# Altium project PhMeasureDevice.PrjPcb
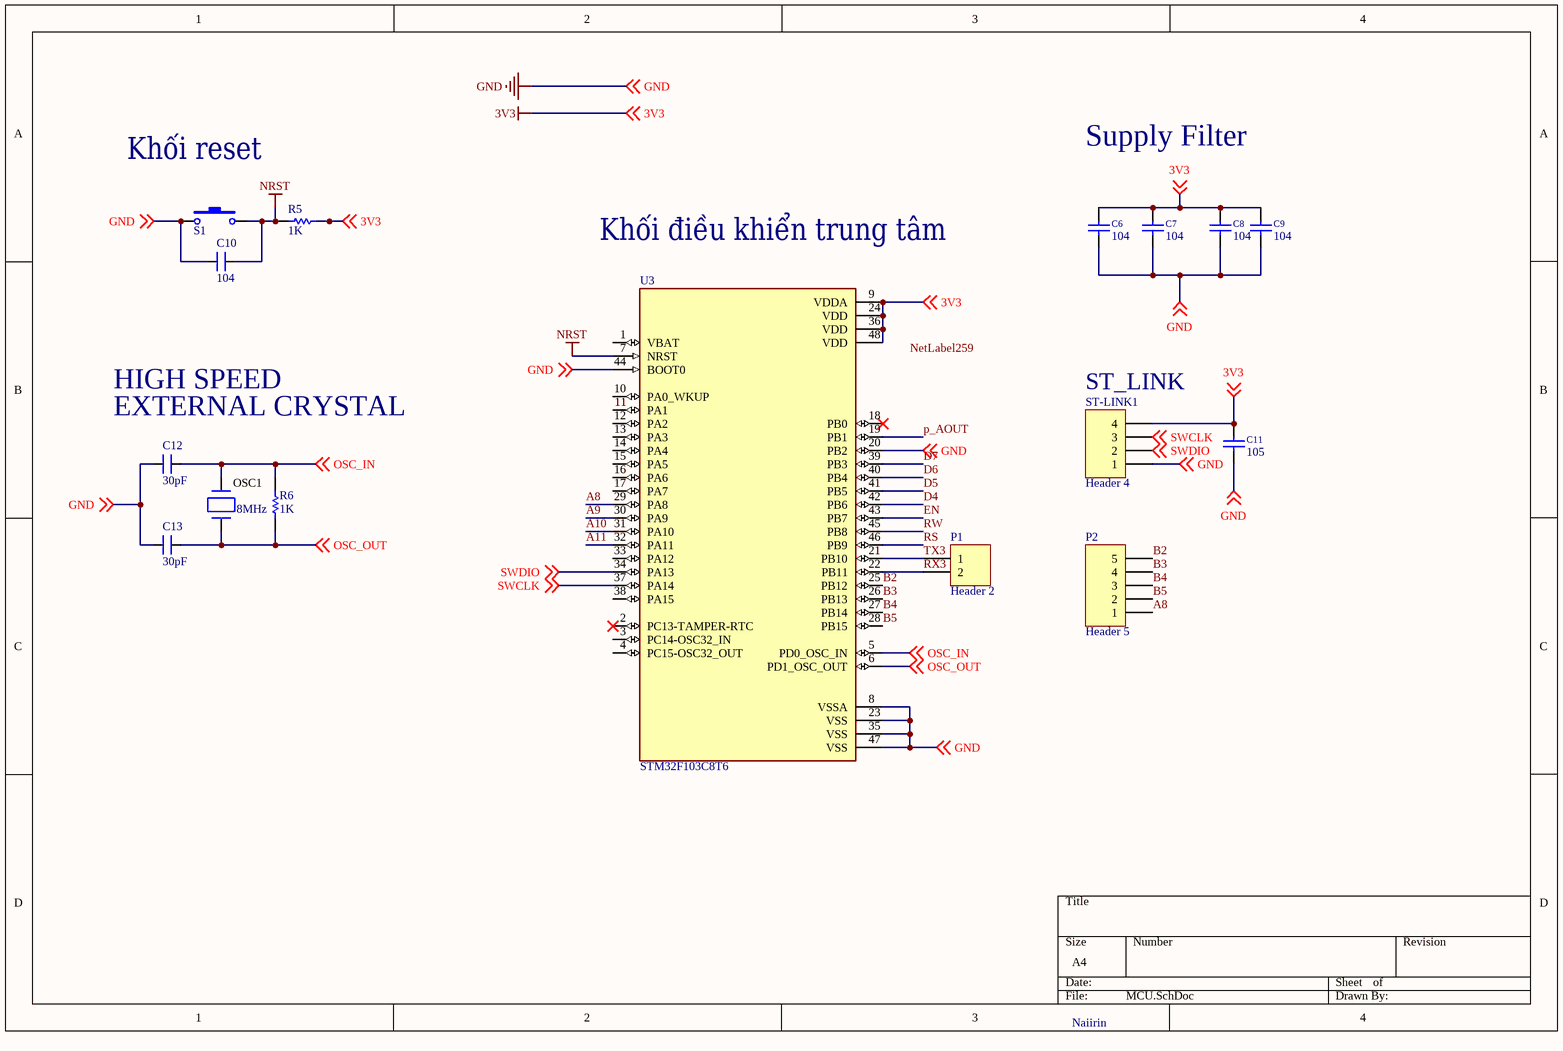
[diagram p0: MCU.SchDoc]
2 sheets, 34 parts. Net scope: global (net labels, ports and power ports of the same name join across sheets).
Board file: PCB1.PcbDoc
Sheets:
  MCU.SchDoc
  Sensor.SchDoc

## Sheet MCU.SchDoc
size A4; SheetNumber: 2; SheetTotal: 2

### Parts
C6  104  [C1608-0603]
C7  104  [C1608-0603]
C8  104  [C1608-0603]
C9  104  [C1608-0603]
C10  104  [SM-0805]
C11  105  [C1608-0603]
C12  30pF  [SM-0805]
C13  30pF  [SM-0805]
OSC1  value 8MHz  [Crystal.HC49/USxx]  (hidden comment: Crystal2)
P1  Header 2  [Header 2]
P2  Header 5  [Header 5]
R5  value 1K  [R-0805]  (hidden comment: RESISTOR)
R6  value 1K  [R-0805]  (hidden comment: RESISTOR)
S1  SW-SMD  [SW-SMD]  (value not drawn)
ST-LINK1  Header 4  [Header 4]
U3  STM32F103C8T6  [QFP50P900X900X160-48N]

### Nets
3V3: C6.2 C7.2 C8.2 C9.2 C11.2 R5.2 ST-LINK1.4 U3.9(VDDA) U3.24(VDD) U3.36(VDD) U3.48(VDD) ; off-sheet 3V3
GND: C6.1 C7.1 C8.1 C9.1 C10.1 C11.1 C12.1 C13.1 S1.1 ST-LINK1.1 U3.8(VSSA) U3.20(PB2) U3.23(VSS) U3.35(VSS) U3.44(BOOT0) U3.47(VSS) ; off-sheet GND
NRST: C10.2 R5.1 S1.2 U3.7(NRST)
A8: P2.1 U3.29(PA8)
A9: U3.30(PA9)
A10: U3.31(PA10)
A11: U3.32(PA11)
B2: P2.5 U3.25(PB12)
B3: P2.4 U3.26(PB13)
B4: P2.3 U3.27(PB14)
B5: P2.2 U3.28(PB15)
D4: U3.42(PB6)
D5: U3.41(PB5)
D6: U3.40(PB4)
D7: U3.39(PB3)
EN: U3.43(PB7)
OSC_IN: C12.2 OSC1.1 R6.2 U3.5(PD0_OSC_IN) ; off-sheet OSC_IN
OSC_OUT: C13.2 OSC1.2 R6.1 U3.6(PD1_OSC_OUT) ; off-sheet OSC_OUT
p_AOUT: U3.19(PB1)
RS: U3.46(PB9)
RW: U3.45(PB8)
RX3: P1.2 U3.22(PB11)
SWCLK: ST-LINK1.3 U3.37(PA14) ; off-sheet SWCLK
SWDIO: ST-LINK1.2 U3.34(PA13) ; off-sheet SWDIO
TX3: P1.1 U3.21(PB10)

Not connected (* = marked no-connect by the designer): U3 1(VBAT) 2(PC13-TAMPER-RTC)* 3(PC14-OSC32_IN) 4(PC15-OSC32_OUT) 10(PA0_WKUP) 11(PA1) 12(PA2) 13(PA3) 14(PA4) 15(PA5) 16(PA6) 17(PA7) 18(PB0)* 33(PA12) 38(PA15)

### Notes on the sheet
- Khối reset
- Supply Filter
- Khối điều khiển trung tâm
- HIGH SPEED
- (near C12) EXTERNAL CRYSTAL
- (near ST-LINK1) ST_LINK
- Naiirin
- Labels drawn without touching a wire or pin: NetLabel259

### Library data of the parts
C6-C9 C11 = Capacitor: AEMS Code: 2100341; Vendor: Digikey; Volt: 16V; Published: 13-April-2009; Publisher: Hoang Nguyen; ComponentLink1Description: Digikey Part Link; ComponentLink2Description: Open Datasheet; ComponentLink2URL: H:\LIBRARY\LIBRARY.Datasheet\
  C6-C9: Value: 104
  C11: Value: 105
C10 C12 C13 = CM: Cap SMD; Value: 103
OSC1 = Crystal2: Quarz Crystal; Vendor: Digikey; Published: 13-April-2009; Publisher: Hoang Nguyen; ComponentLink1Description: Digikey Part Link; ComponentLink2Description: Open Datasheet; ComponentLink2URL: H:\LIBRARY\LIBRARY.Datasheet\; Price: 2000 VND
P1 = Header 2: Header, 2-Pin; LatestRevisionDate: 17-Jul-2002; LatestRevisionNote: Re-released for DXP Platform.; Publisher: Altium Limited
P2 = Header 5: Header, 5-Pin; LatestRevisionDate: 17-Jul-2002; LatestRevisionNote: Re-released for DXP Platform.; Publisher: Altium Limited
S1 = SW-SMD: Switch; Published: 24-Mar-1999; LatestRevisionDate: 17-Jul-2002; LatestRevisionNote: Re-released for DXP Platform.; PackageReference: SPST-2; Publisher: Altium Limited
ST-LINK1 = Header 4: Header, 4-Pin; LatestRevisionDate: 17-Jul-2002; LatestRevisionNote: Re-released for DXP Platform.; Publisher: Altium Limited
U3 = STM32F103C8T6: ARMÂ® CortexÂ®-M3 STM32F1 Microcontroller IC 32-Bit 72MHz 64KB (64K x 8) FLASH 48-LQFP (7x7); MF: STMicroelectronics; Package: LQFP-48 STMicroelectronics; Price: None; Check_prices: https://www.snapeda.com/parts/STM32F103C8T6/STMicroelectronics/view-part/?ref=eda; Value: *; SnapEDA_Link: https://www.snapeda.com/parts/STM32F103C8T6/STMicroelectronics/view-part/?ref=snap; MP: STM32F103C8T6; Availability: In Stock; Purchase-URL: https://pricing.snapeda.com/search/part/STM32F103C8T6/?ref=eda
R5 R6 = RESISTOR: Published: 8-Jun-2000; LatestRevisionDate: 17-Jul-2002; LatestRevisionNote: Re-released for DXP Platform.; PackageReference: AXIAL-0.3; Publisher: Altium Limited

## Sheet Sensor.SchDoc
size A4; SheetNumber: 1; SheetTotal: 2
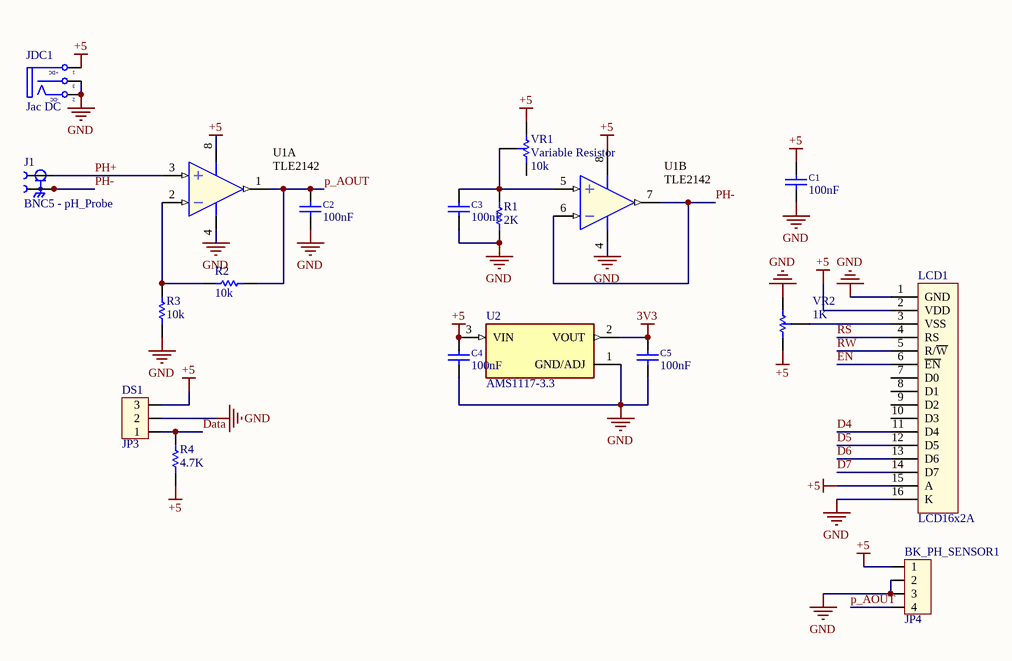
[diagram p1: Sensor.SchDoc]

### Parts
BK_PH_SENSOR1  JP4  [CON4]
C1  100nF  [C2012-0805]
C2  100nF  [C2012-0805]
C3  100nF  [C2012-0805]
C4  100nF  [C2012-0805]
C5  100nF  [C2012-0805]
DS1  JP3  [CON3]
J1  BNC5 - pH_Probe  [SAMTEC_BNC5-J-P-GN-RA-BH2D]
JDC1  Jac DC  [DC-IN]
LCD1  LCD16x2A  [LCD16X2]
R1  value 2K  [R-0805]  (hidden comment: RESISTOR)
R2  value 10k  [R-0805]  (hidden comment: RESISTOR)
R3  value 10k  [R-0805]  (hidden comment: RESISTOR)
R4  value 4.7K  [R-0805]  (hidden comment: RESISTOR)
U1  TLE2142  [SOIC8]  (parts A,B of 2)
U2  AMS1117-3.3  [SOT229P700X180-4N]
VR1  Variable Resistor  value 10k  [VRes-R]
VR2  value 1K  [VRes-C]

### Nets
3V3: C5.2 U2.2(VOUT)
+5: BK_PH_SENSOR1.1 C1.2 C4.2 DS1.3 JDC1.1(T) LCD1.2(VDD) LCD1.15(A) R4.1 U1.8(V+) U2.3(VIN) VR1.1 VR2.1
GND: BK_PH_SENSOR1.2 BK_PH_SENSOR1.3 C1.1 C2.1 C3.1 C4.1 C5.1 DS1.2 JDC1.2(TN) JDC1.3(S) LCD1.1(GND) LCD1.16(K) R1.1 R3.1 U1.4(GND) U2.1(GND/ADJ) VR2.3
D4: LCD1.11(D4)
D5: LCD1.12(D5)
D6: LCD1.13(D6)
D7: LCD1.14(D7)
Data: DS1.1 R4.2
EN: LCD1.6(~{EN})
p_AOUT: BK_PH_SENSOR1.4 C2.2 R2.2 U1.1(OUT)
PH+: J1.1 U1.3(IN+)
PH-: J1.S_1 J1.S_2 J1.S_3 J1.S_4 U1.6(IN-) U1.7(OUT)
RS: LCD1.4(RS)
RW: LCD1.5(R/~{W})
NetC3_2: C3.2 R1.2 U1.5(IN+) VR1.2
NetLCD1_3: LCD1.3(VSS) VR2.2
NetR2_1: R2.1 R3.2 U1.2(IN-)

Not connected (* = marked no-connect by the designer): LCD1 7(D0) 8(D1) 9(D2) 10(D3); VR1 3

### Notes on the sheet
- (in symbol DCIN) +DC; -DC

### Library data of the parts
BK_PH_SENSOR1 = Con4: Connector 4; Value: Connector 4
C1-C5 = Capacitor: as C6 on sheet MCU; Published: 13-April-2009; Publisher: Hoang Nguyen; ComponentLink1Description: Digikey Part Link; ComponentLink2Description: Open Datasheet; ComponentLink2URL: H:\LIBRARY\LIBRARY.Datasheet\; Value: 100nF
DS1 = Con3: Connector 3; Value: Connector 3
J1 = BNC5-J-P-GN-RA-BH2D: BNC Connector Jack, Female Socket 50Ohm Panel Mount, Through Hole, Right Angle Solder; MF: Samtec; Value: *; SnapEDA_Link: https://www.snapeda.com/parts/BNC5-J-P-GN-RA-BH2D/Samtec%20Inc./view-part/933377/?ref=snap; MP: BNC5-J-P-GN-RA-BH2D; Check_prices: https://www.snapeda.com/parts/BNC5-J-P-GN-RA-BH2D/Samtec%20Inc./view-part/933377/?ref=eda; Purchase-URL: https://pricing.snapeda.com/search/part/BNC5-J-P-GN-RA-BH2D/?ref=eda; Availability: In Stock; Price: None; Package: None
JDC1 = DCIN: Jac DC input; Value: Jac DC
LCD1 = LCD16x2: LCD dipslay 16 char, 2 line; Value: LCD16x2A
U1 = LM2904: Low-Power Dual Operational Amplifier; Published: 15-Apr-2002; LatestRevisionDate: 06-Jun-2005; LatestRevisionNote: Stylized 3D Model Added.; DatasheetVersion: Sep-1999; PackageVersion: Sep-1997; PackageReference: N08E; Publisher: Altium Limited; PackageDescription: DIP; 8 Leads; Row Spacing 7.62 mm; Pitch 2.54 mm; ComponentLink1Description: Manufacturer Link; ComponentLink1URL: http://www.national.com/; ComponentLink2Description: Datasheet; ComponentLink2URL: http://www.national.com/ds.cgi/LM/LM158.pdf; ComponentLink3Description: URL Link1; ComponentLink3URL: http://www.national.com/pf/LM/LM358.html
U2 = AMS1117-3.3: Sot223/Pkg 1-Amp 3.3-Volt Low Drop Out Voltage Regulatator; MF: Advanced Monolithic Systems; Package: SOT-223 Seeed Technology; Value: *; Check_prices: https://www.snapeda.com/parts/AMS1117-3.3/Advanced+Monolithic+Systems/view-part/?ref=eda; Price: None; Availability: Not in stock; MP: AMS1117-3.3; SnapEDA_Link: https://www.snapeda.com/parts/AMS1117-3.3/Advanced+Monolithic+Systems/view-part/?ref=snap
VR2 = Variable Resistor: Published: 8-Jun-2000; LatestRevisionDate: 17-Jul-2002; LatestRevisionNote: Re-released for DXP Platform.; PackageReference: AXIAL-0.3; Publisher: Altium Limited
R1-R4 = RESISTOR: Published: 8-Jun-2000; LatestRevisionDate: 17-Jul-2002; LatestRevisionNote: Re-released for DXP Platform.; PackageReference: AXIAL-0.3; Publisher: Altium Limited
VR1 = Variable Resistor: Published: 8-Jun-2000; LatestRevisionDate: 17-Jul-2002; LatestRevisionNote: Re-released for DXP Platform.; PackageReference: AXIAL-0.3; Publisher: Altium Limited

## Nets that join several sheets
3V3: MCU (11 pins), Sensor (C5.2 U2.2)
GND: MCU (16 pins), Sensor (17 pins)
D4: MCU (U3.42), Sensor (LCD1.11)
D5: MCU (U3.41), Sensor (LCD1.12)
D6: MCU (U3.40), Sensor (LCD1.13)
D7: MCU (U3.39), Sensor (LCD1.14)
EN: MCU (U3.43), Sensor (LCD1.6)
p_AOUT: MCU (U3.19), Sensor (BK_PH_SENSOR1.4 C2.2 R2.2 U1.1)
RS: MCU (U3.46), Sensor (LCD1.4)
RW: MCU (U3.45), Sensor (LCD1.5)